# EAGLE design attiny_shield (EAGLE 8.6.1)
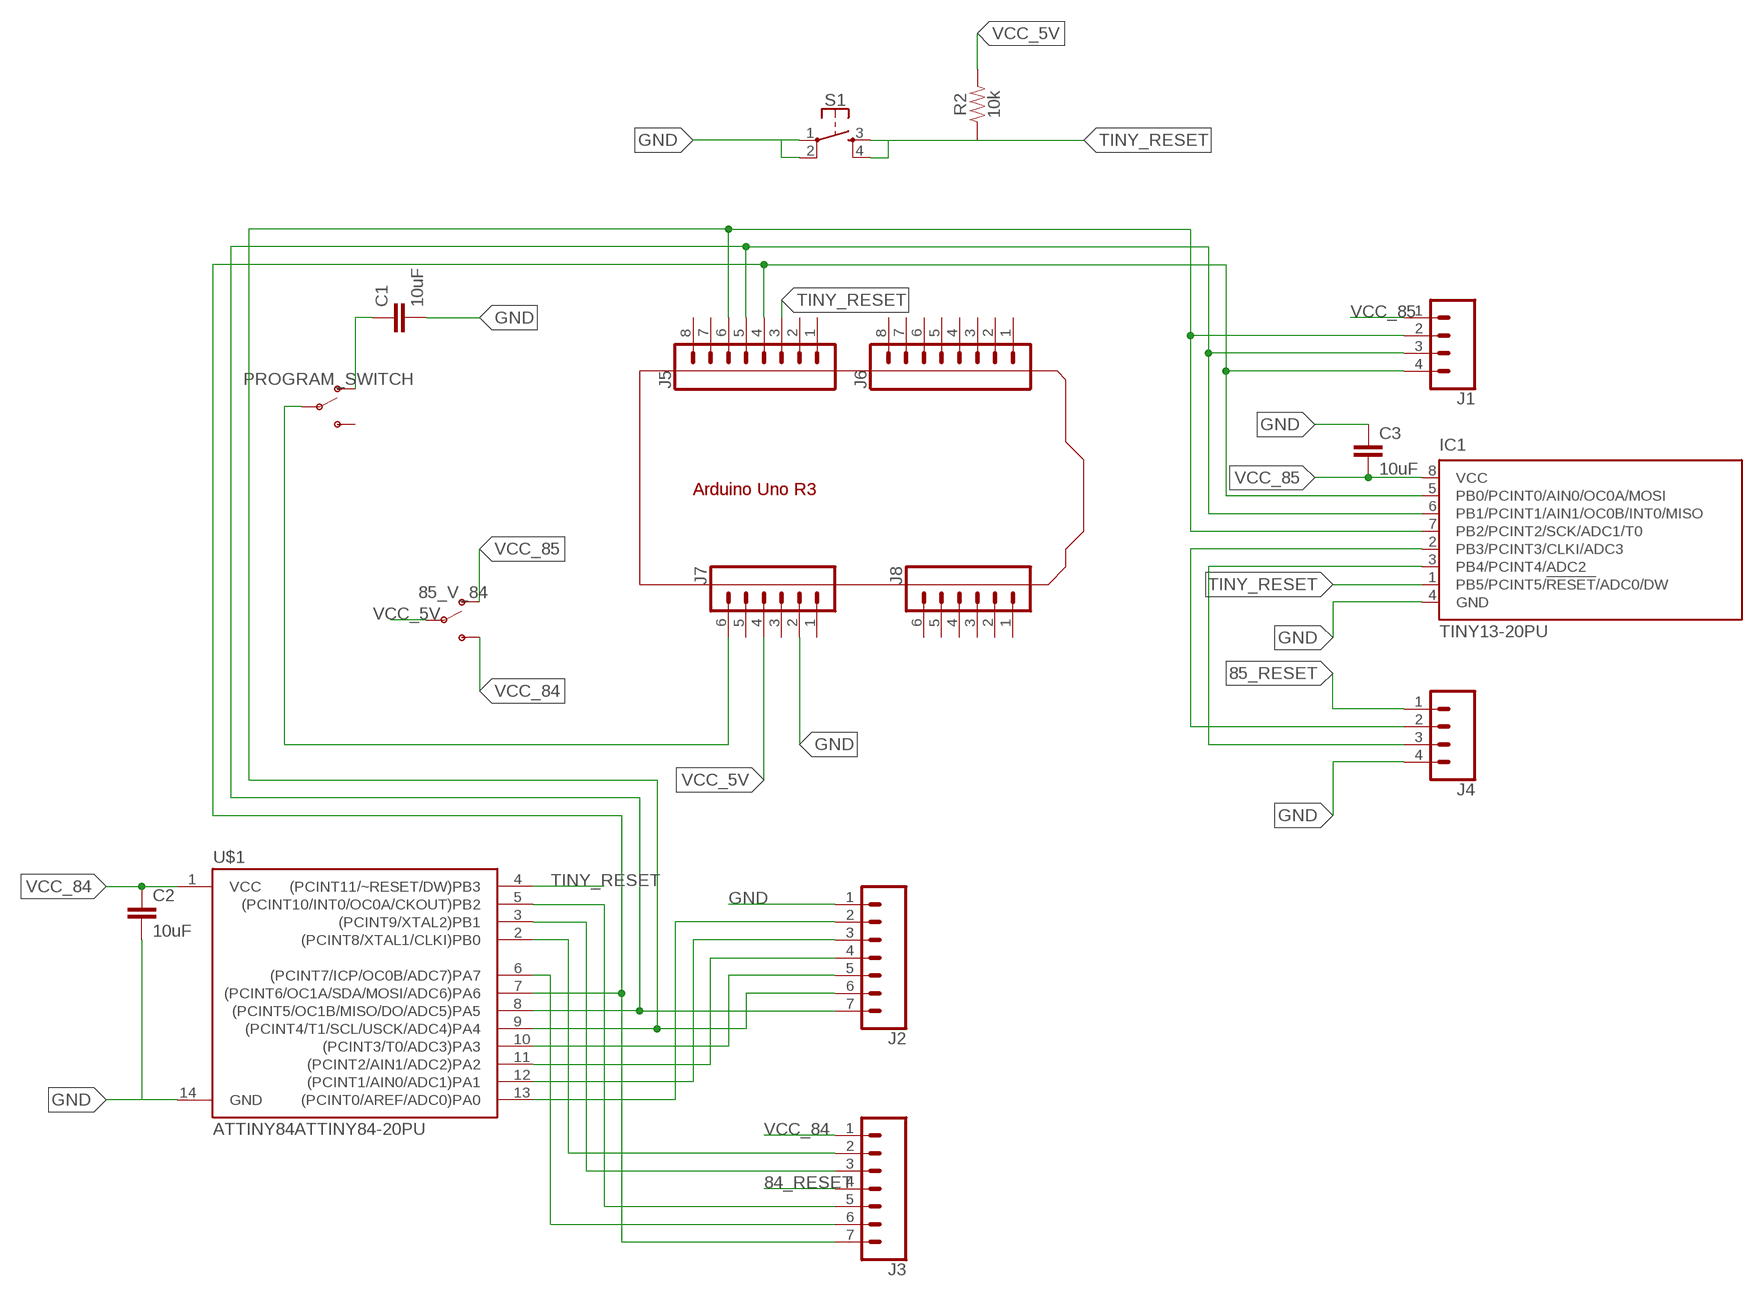
[diagram p0: schematic, sheet 1]

## Parts
85_V_84  SPARKFUN-SWITCHES_SWITCH-SPDT-SMD-AYZ0202  [SPARKFUN-SWITCHES_SWITCH_DPDT_SMD_AYZ0202]
C1  10uF  10UF-0805-10V-10%  [0805]
C2  10uF  10UF-0805-10V-10%  [0805]
C3  10uF  10UF-0805-10V-10%  [0805]
IC1  TINY13-20PU  [DIL08]
J1  CONN_04  [1X04]
J2  CONN_07  [1X07]
J3  CONN_07  [1X07]
J4  CONN_04  [1X04]
J5  CONN_08"  [1X08]
J6  CONN_08"  [1X08]
J7  CONN_06SILK_FEMALE_PTH  [1X06]
J8  CONN_06SILK_FEMALE_PTH  [1X06]
PROGRAM_SWITCH  SWITCH-SPDT-SMD-AYZ0202  [SWITCH_DPDT_SMD_AYZ0202]
R2  10k  SPARKFUN-RESISTORS_10KOHM-0603-1/10W-1%  [SPARKFUN-RESISTORS_0603]
S1  SPARKFUN-SWITCHES_MOMENTARY-SWITCH-SPST-2-SMD-5.2MM  [SPARKFUN-SWITCHES_TACTILE_SWITCH_SMD_5.2MM]
U$1  ATTINY84ATTINY84-20PU  [DIP14]

## Nets
84_0: J2.2 U$1.13((PCINT0/AREF/ADC0)PA0)
84_1: J2.3 U$1.12((PCINT1/AIN0/ADC1)PA1)
84_RESET: J3.4
85_RESET: J4.1
GND: C1.2 C2.2 C3.1 IC1.4(GND) J2.1 J4.4 J7.2 S1.1 S1.2 U$1.14(GND)
MISO: IC1.6(PB1/PCINT1/AIN1/OC0B/INT0/MISO) J1.3 J2.7 J5.5 U$1.8((PCINT5/OC1B/MISO/DO/ADC5)PA5)
MOSI: IC1.5(PB0/PCINT0/AIN0/OC0A/MOSI) J1.4 J3.7 J5.4 U$1.7((PCINT6/OC1A/SDA/MOSI/ADC6)PA6)
N$1: C1.1 PROGRAM_SWITCH.1(O)
N$2: IC1.2(PB3/PCINT3/CLKI/ADC3) J4.2
N$3: IC1.3(PB4/PCINT4/ADC2) J4.3
N$10: J7.6 PROGRAM_SWITCH.2(P)
N$14: J2.4 U$1.11((PCINT2/AIN1/ADC2)PA2)
N$15: J2.5 U$1.10((PCINT3/T0/ADC3)PA3)
N$17: J3.6 U$1.6((PCINT7/ICP/OC0B/ADC7)PA7)
N$18: J3.2 U$1.2((PCINT8/XTAL1/CLKI)PB0)
N$19: J3.3 U$1.3((PCINT9/XTAL2)PB1)
N$20: J3.5 U$1.5((PCINT10/INT0/OC0A/CKOUT)PB2)
SCK: IC1.7(PB2/PCINT2/SCK/ADC1/T0) J1.2 J2.6 J5.6 U$1.9((PCINT4/T1/SCL/USCK/ADC4)PA4)
TINY_RESET: IC1.1(PB5/PCINT5/!RESET!/ADC0/DW) J5.3 R2.1 S1.3 S1.4 U$1.4((PCINT11/~RESET/DW)PB3)
VCC_5V: 85_V_84.2(P) J7.4 R2.2
VCC_84: 85_V_84.3(S) C2.1 J3.1 U$1.1(VCC)
VCC_85: 85_V_84.1(O) C3.2 IC1.8(VCC) J1.1
Unconnected: J5.1 J5.2 J5.7 J5.8 J6.1 J6.2 J6.3 J6.4 J6.5 J6.6 J6.7 J6.8 J7.1 J7.3 J7.5 J8.1 J8.2 J8.3 J8.4 J8.5 J8.6 PROGRAM_SWITCH.3(S)

## Notes on the sheet
- Arduino Uno R3 | Arduino Uno R3

## Library data of the parts
85_V_84 = PianoPiano:SPARKFUN-SWITCHES_SWITCH-SPDT: Single Pole, Double Throw (SPDT) Switch Single-pole, double-throw (SPDT) switch. Variant Overview SMD-AYZ0202 Surface Mount DPDT Switch <https://www.sparkfun.com/products/597> (COM-00597) Used on e.g. LilyPad Arduino USB - ATmega32U4 Board <https://www.sparkfun.com/products/12049> PTH-11.6X4.0MM SPDT Mini Power Switch <https://www.sparkfun.com/products/102> (COM-00102) Used on e.g. SparkFun Simon Says - Through-Hole Soldering Kit <https://www.sparkfun.com/products/10547> (KIT-10547) PTH-11.6X4.0MM-KIT KIT version of SPDT Mini Power Switch - Simplifies soldering by removing tStop of switch pins - only one side can be soldered. PTH-11.6X4.0MM-LOCK LOCK version of SPDT Mini Power Switch - Offset pins hold switch in place for easier soldering. SMD-RIGHT-ANGLE Surface Mount Right Angle Switch <https://www.sparkfun.com/products/10860> (COM-10860) Used on e.g. SparkFun ESP8266 Thing <https://www.sparkfun.com/products/13231>; PROD_ID: SWCH-08179; SF_ID: COM-00597
C1-C3 = SparkFun-Capacitors:10UF: 10.0µF ceramic capacitors A capacitor is a passive two-terminal electrical component used to store electrical energy temporarily in an electric field.; PROD_ID: CAP-11330
IC1 = atmel:TINY13: 8-bit AVR Microcontroller with 1K Bytes In-System Programmable Flash Source: http://www.atmel.com/dyn/resources/prod_documents/2535S.pdf; MPN: ATTINY13-20PU; OC_FARNELL: 9171550; OC_NEWARK: 96K6521
J1 J4 = SparkFun-Connectors:CONN_04: Multi connection point. Often used as Generic Header-pin footprint for 0.1 inch spaced/style header connections On any of the 0.1 inch spaced packages, you can populate with these: Break Away Headers - Straight <https://www.sparkfun.com/products/116> (PRT-00116) Break Away Male Headers - Right Angle <https://www.sparkfun.com/products/553> (PRT-00553) Female Headers <https://www.sparkfun.com/products/115> (PRT-00115) Break Away Headers - Machine Pin <https://www.sparkfun.com/products/117> (PRT-00117) Break Away Female Headers - Swiss Machine Pin <https://www.sparkfun.com/products/743> (PRT-00743) For SCREWTERMINALS and SPRING TERMINALS visit here: Screw Terimnals on SparkFun.com <https://www.sparkfun.com/search/results?term=Screw+Terminals> (5mm/3.5mm/2.54mm spacing) This device is also useful as a general connection point to wire up your design to another part of your project. Our various solder wires solder well into these plated through hole pads. Hook-Up Wire - Assortment (Stranded, 22 AWG) <https://www.sparkfun.com/products/11375> (PRT-11375) Hook-Up Wire - Assortment (Solid Core, 22 AWG) <https://www.sparkfun.com/products/11367> (PRT-11367) View the entire wire category on our website here <https://www.sparkfun.com/categories/141> Special notes: Molex polarized connector foot print use with SKU : PRT-08231 with associated crimp pins and housings. 1MM SMD Version SKU: PRT-10208; PROD_ID: CONN-09696
J2 J3 = SparkFun-Connectors:CONN_07: Multi connection point. Often used as Generic Header-pin footprint for 0.1 inch spaced/style header connections On any of the 0.1 inch spaced packages, you can populate with these: Break Away Headers - Straight <https://www.sparkfun.com/products/116> (PRT-00116) Break Away Male Headers - Right Angle <https://www.sparkfun.com/products/553> (PRT-00553) Female Headers <https://www.sparkfun.com/products/115> (PRT-00115) Break Away Headers - Machine Pin <https://www.sparkfun.com/products/117> (PRT-00117) Break Away Female Headers - Swiss Machine Pin <https://www.sparkfun.com/products/743> (PRT-00743) For SCREWTERMINALS and SPRING TERMINALS visit here: Screw Terimnals on SparkFun.com <https://www.sparkfun.com/search/results?term=Screw+Terminals> (5mm/3.5mm/2.54mm spacing) This device is also useful as a general connection point to wire up your design to another part of your project. Our various solder wires solder well into these plated through hole pads. Hook-Up Wire - Assortment (Stranded, 22 AWG) <https://www.sparkfun.com/products/11375> (PRT-11375) Hook-Up Wire - Assortment (Solid Core, 22 AWG) <https://www.sparkfun.com/products/11367> (PRT-11367) View the entire wire category on our website here <https://www.sparkfun.com/categories/141> Special notes: Molex polarized connector foot print use with SKU : PRT-08231 with associated crimp pins and housings. 1MM SMD Version SKU: PRT-10208 NOTES ON THE VARIANTS LOCK and LOCK_LONGPADS... This footprint was designed to help hold the alignment of a through-hole component (i.e. 6-pin header) while soldering it into place. You may notice that each hole has been shifted either up or down by 0.005 of an inch from it's more standard position (which is a perfectly straight line). This slight alteration caused the pins (the squares in the middle) to touch the edges of the holes. Because they are alternating, it causes a "brace" to hold the component in place. 0.005 has proven to be the perfect amount of "off-center" position when using our standard breakaway headers. Although looks a little odd when you look at the bare footprint, once you have a header in there, the alteration is very hard to notice. Also,if you push a header all the way into place, it is covered up entirely on the bottom side.
J5 J6 = SparkFun-Connectors:CONN_08: Multi connection point. Often used as Generic Header-pin footprint for 0.1 inch spaced/style header connections On any of the 0.1 inch spaced packages, you can populate with these: Break Away Headers - Straight <https://www.sparkfun.com/products/116> (PRT-00116) Break Away Male Headers - Right Angle <https://www.sparkfun.com/products/553> (PRT-00553) Female Headers <https://www.sparkfun.com/products/115> (PRT-00115) Break Away Headers - Machine Pin <https://www.sparkfun.com/products/117> (PRT-00117) Break Away Female Headers - Swiss Machine Pin <https://www.sparkfun.com/products/743> (PRT-00743) Arduino Stackable Header - 8 Pin <https://www.sparkfun.com/products/9279> (PRT-09279) For SCREWTERMINALS and SPRING TERMINALS visit here: Screw Terimnals on SparkFun.com <https://www.sparkfun.com/search/results?term=Screw+Terminals> (5mm/3.5mm/2.54mm spacing) This device is also useful as a general connection point to wire up your design to another part of your project. Our various solder wires solder well into these plated through hole pads. Hook-Up Wire - Assortment (Stranded, 22 AWG) <https://www.sparkfun.com/products/11375> (PRT-11375) Hook-Up Wire - Assortment (Solid Core, 22 AWG) <https://www.sparkfun.com/products/11367> (PRT-11367) View the entire wire category on our website here <https://www.sparkfun.com/categories/141> Special notes: Molex polarized connector foot print use with SKU : PRT-08231 with associated crimp pins and housings. 1MM SMD Version SKU: PRT-10208 NOTES ON THE VARIANTS LOCK and LOCK_LONGPADS... This footprint was designed to help hold the alignment of a through-hole component (i.e. 6-pin header) while soldering it into place. You may notice that each hole has been shifted either up or down by 0.005 of an inch from it's more standard position (which is a perfectly straight line). This slight alteration caused the pins (the squares in the middle) to touch the edges of the holes. Because they are alternating, it causes a "brace" to hold the component in place. 0.005 has proven to be the perfect amount of "off-center" position when using our standard breakaway headers. Although looks a little odd when you look at the bare footprint, once you have a header in there, the alteration is very hard to notice. Also,if you push a header all the way into place, it is covered up entirely on the bottom side.; PROD_ID: CONN-08438
J7 J8 = SparkFun-Connectors:CONN_06: Multi connection point. Often used as Generic Header-pin footprint for 0.1 inch spaced/style header connections On any of the 0.1 inch spaced packages, you can populate with these: Break Away Headers - Straight <https://www.sparkfun.com/products/116> (PRT-00116) Break Away Male Headers - Right Angle <https://www.sparkfun.com/products/553> (PRT-00553) Female Headers <https://www.sparkfun.com/products/115> (PRT-00115) Break Away Headers - Machine Pin <https://www.sparkfun.com/products/117> (PRT-00117) Break Away Female Headers - Swiss Machine Pin <https://www.sparkfun.com/products/743> (PRT-00743) Arduino Stackable Header - 6 Pin <https://www.sparkfun.com/products/9280> (PRT-09280) For SCREWTERMINALS and SPRING TERMINALS visit here: Screw Terimnals on SparkFun.com <https://www.sparkfun.com/search/results?term=Screw+Terminals> (5mm/3.5mm/2.54mm spacing) This device is also useful as a general connection point to wire up your design to another part of your project. Our various solder wires solder well into these plated through hole pads. Hook-Up Wire - Assortment (Stranded, 22 AWG) <https://www.sparkfun.com/products/11375> (PRT-11375) Hook-Up Wire - Assortment (Solid Core, 22 AWG) <https://www.sparkfun.com/products/11367> (PRT-11367) View the entire wire category on our website here <https://www.sparkfun.com/categories/141>; PROD_ID: CONN-08437
PROGRAM_SWITCH = SparkFun-Switches:SWITCH-SPDT: Single Pole, Double Throw (SPDT) Switch Single-pole, double-throw (SPDT) switch. Variant Overview SMD-AYZ0202 Surface Mount DPDT Switch <https://www.sparkfun.com/products/597> (COM-00597) Used on e.g. LilyPad Arduino USB - ATmega32U4 Board <https://www.sparkfun.com/products/12049> PTH-11.6X4.0MM SPDT Mini Power Switch <https://www.sparkfun.com/products/102> (COM-00102) Used on e.g. SparkFun Simon Says - Through-Hole Soldering Kit <https://www.sparkfun.com/products/10547> (KIT-10547) PTH-11.6X4.0MM-KIT KIT version of SPDT Mini Power Switch - Simplifies soldering by removing tStop of switch pins - only one side can be soldered. PTH-11.6X4.0MM-LOCK LOCK version of SPDT Mini Power Switch - Offset pins hold switch in place for easier soldering. SMD-RIGHT-ANGLE Surface Mount Right Angle Switch <https://www.sparkfun.com/products/10860> (COM-10860) Used on e.g. SparkFun ESP8266 Thing <https://www.sparkfun.com/products/13231>; PROD_ID: SWCH-08179; SF_ID: COM-00597
R2 = PianoPiano:SPARKFUN-RESISTORS_10KOHM: 10kΩ resistor A resistor is a passive two-terminal electrical component that implements electrical resistance as a circuit element. Resistors act to reduce current flow, and, at the same time, act to lower voltage levels within circuits. - Wikipedia; PROD_ID: RES-00824
S1 = PianoPiano:SPARKFUN-SWITCHES_MOMENTARY-SWITCH-SPST-2: Momentary Switch (Pushbutton) - SPST - Two Circuits Normally-open (NO) SPST momentary switches (buttons, pushbuttons). Schematic symbol includes two switch circuits. Variants SMD-4.6MMX2.8MM - 4.60mm x 2.80mm Tactile Momentary Button Switch - Used on SparkFun SAMD21 Mini Breakout <https://www.sparkfun.com/products/13664> SMD-5.2MM - Mini Pushbutton Switch - SMD <https://www.sparkfun.com/products/8720> - Used on Arduino Pro Mini <https://www.sparkfun.com/products/11114>; PROD_ID: SWCH-08247; SF_SKU: COM-08720
U$1 = SparkFun-IC-Microcontroller:ATTINY84: Atmel 14-pin 2/4/8kB flash uC Datasheet <https://cdn.sparkfun.com/datasheets/Widgets/doc8006.pdf> SparkFun Products Tiny AVR Programmer <https://www.sparkfun.com/products/11801> (PGM-11801) SparkFun Servo Trigger - Continuous Rotation <https://www.sparkfun.com/products/13872> (WIG-13872) SparkFun Servo Trigger <https://www.sparkfun.com/products/13118> (WIG-13118)

## Board
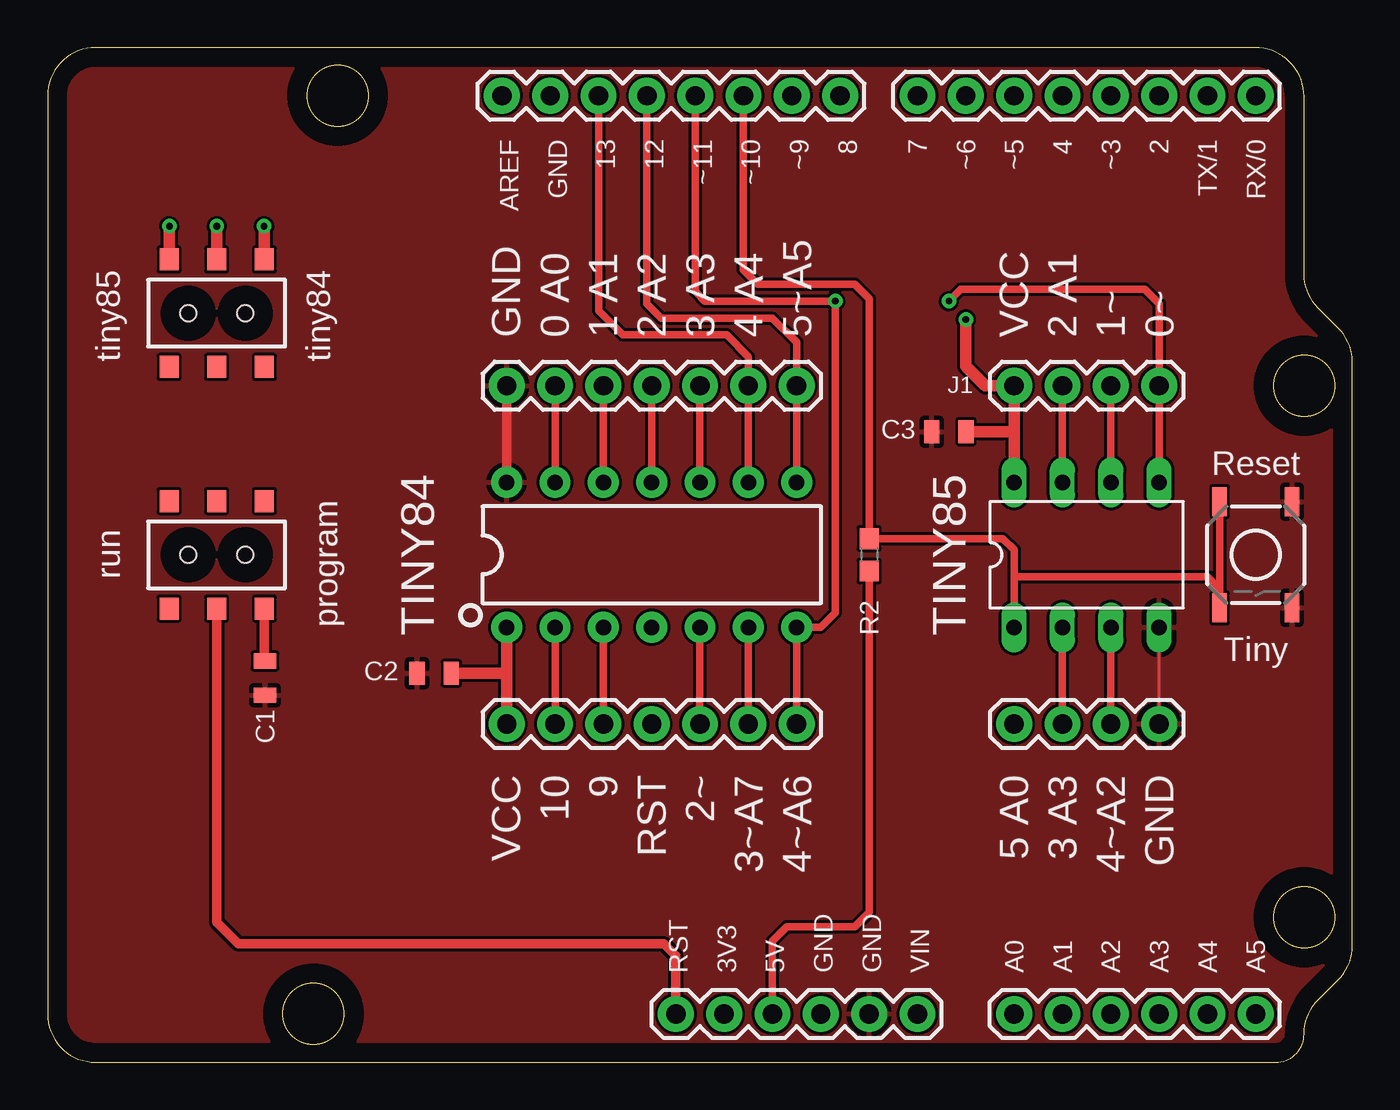
[diagram p1: board, top side]
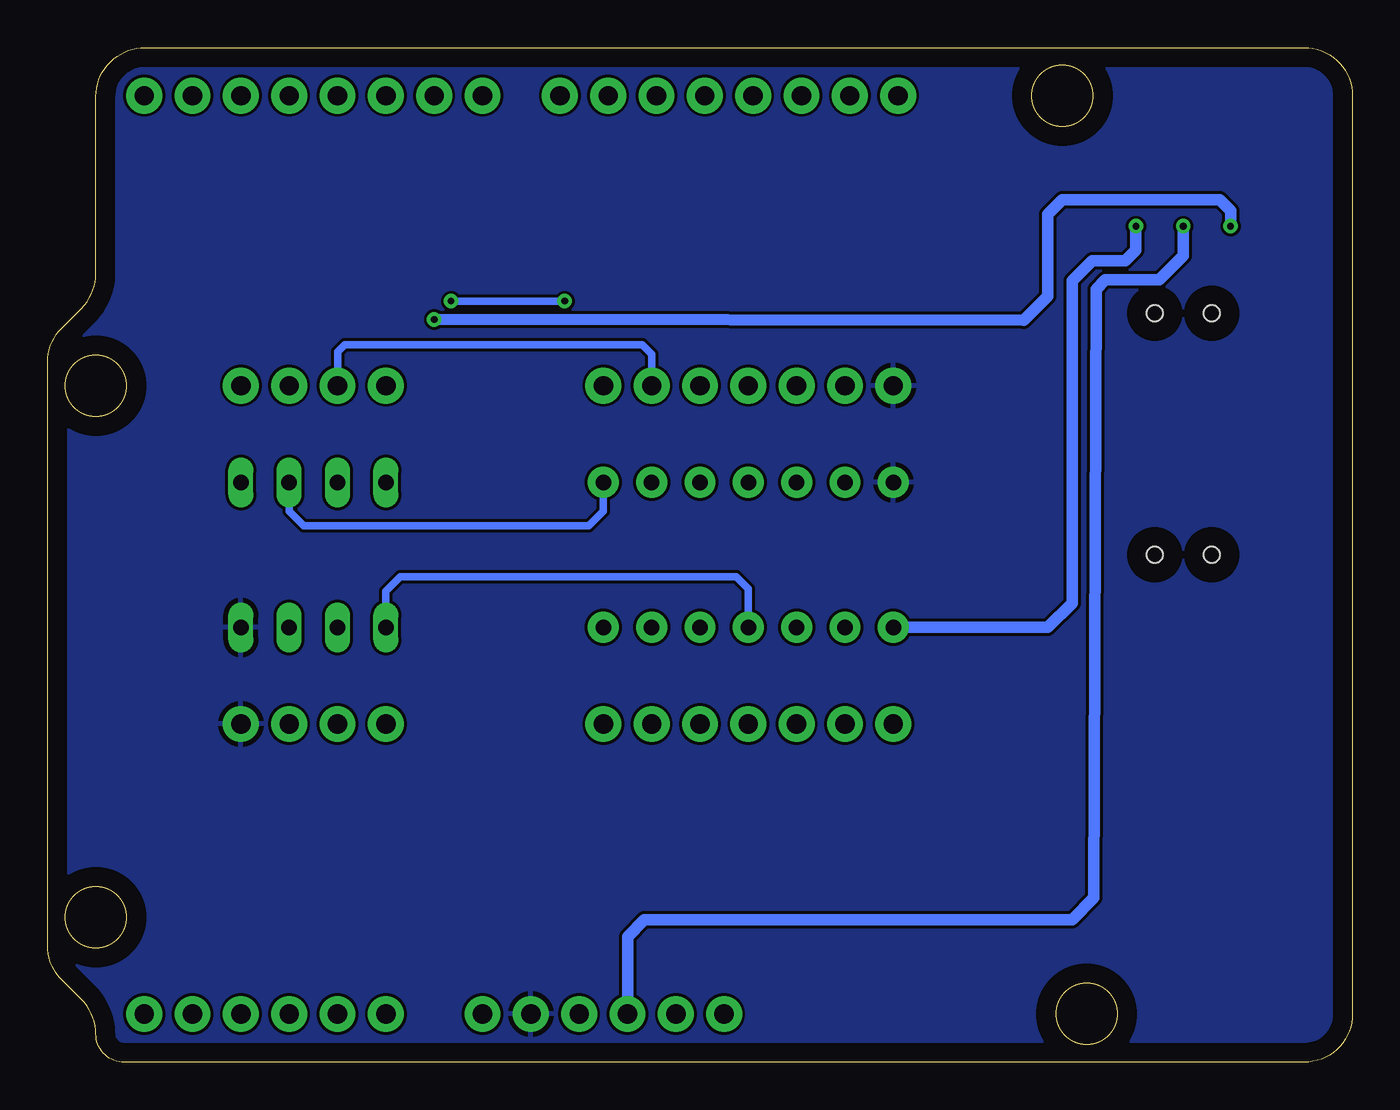
[diagram p2: board, bottom side, seen from below]

Size 68.58 x 53.33 mm. Coordinates in mm from the lower left corner, seen from the top.
Outline: 0,50.79 0,2.54 arc90 2.54,0 64.55,0 arc90 66.04,1.49 arc-45 66.78,3.28 67.84,4.34 arc45 68.58,6.13 68.58,36.79 arc45 67.84,38.59 66.78,39.64 arc-45 66.04,41.44 66.04,50.76 arc45 65.3,52.56 65.27,52.59 arc45 63.47,53.33 2.54,53.33 arc90 0,50.79
Outline: circle at 15.24,50.8 radius 1.61
Outline: circle at 66.04,35.56 radius 1.61
Outline: circle at 66.04,7.62 radius 1.61
Outline: circle at 13.97,2.54 radius 1.61
Copper layers (1*16): Top 0.035mm / dielectric 1.5mm / Bottom 0.035mm
Design rules "default": minimum track width 6mil, minimum drill 0.35mm, track to track 6mil, track to pad 6mil, pad to pad 6mil, via to via 6mil, smd to smd 6mil, copper to edge 40mil, drill to drill 6mil, minimum pad ring 10mil, minimum via ring 8mil, stop-mask expansion 4mil, vias tented up to drill 0mil, thermal gap 10mil

### Footprints (pad centres in the part's own frame; a part is rotated, then mirrored left to right if it is on the bottom)
SPARKFUN-SWITCHES_SWITCH_DPDT_SMD_AYZ0202 = smd 1 x 1.15: 1 -2.5,2.825; 2 0,2.825; 3 2.5,2.825; 4 -2.5,-2.825; 5 0,-2.825; 6 2.5,-2.825 | hole 0.85: 1.5,0; -1.5,0
0805 = smd 0.8 x 1.2: 1 -0.9,0; 2 0.9,0
DIL08 = drill 0.813 long: 1 -3.81,-3.81; 2 -1.27,-3.81; 3 1.27,-3.81; 4 3.81,-3.81; 5 3.81,3.81; 6 1.27,3.81; 7 -1.27,3.81; 8 -3.81,3.81
1X04 = drill 1.016 pad 1.88: 1 0,0; 2 2.54,0; 3 5.08,0; 4 7.62,0
1X07 = drill 1.016 pad 1.88: 1 0,0; 2 2.54,0; 3 5.08,0; 4 7.62,0; 5 10.16,0; 6 12.7,0; 7 15.24,0
1X08 = drill 1.016 pad 1.88: 1 0,0; 2 2.54,0; 3 5.08,0; 4 7.62,0; 5 10.16,0; 6 12.7,0; 7 15.24,0; 8 17.78,0
1X06 = drill 1.016 pad 1.88: 1 0,0; 2 2.54,0; 3 5.08,0; 4 7.62,0; 5 10.16,0; 6 12.7,0
SWITCH_DPDT_SMD_AYZ0202 = smd 1 x 1.15: 1 -2.5,2.825; 2 0,2.825; 3 2.5,2.825; 4 -2.5,-2.825; 5 0,-2.825; 6 2.5,-2.825 | hole 0.85: 1.5,0; -1.5,0
SPARKFUN-RESISTORS_0603 = smd 1.1 x 1: 1 -0.85,0; 2 0.85,0
SPARKFUN-SWITCHES_TACTILE_SWITCH_SMD_5.2MM = smd 1.524 x 0.762: 1 -2.794,1.905; 2 2.794,1.905; 3 -2.794,-1.905; 4 2.794,-1.905
DIP14 = drill 0.813 pad 1.626: 1 -7.62,-3.81; 2 -5.08,-3.81; 3 -2.54,-3.81; 4 0,-3.81; 5 2.54,-3.81; 6 5.08,-3.81; 7 7.62,-3.81; 8 7.62,3.81; 9 5.08,3.81; 10 2.54,3.81; 11 0,3.81; 12 -2.54,3.81; 13 -5.08,3.81; 14 -7.62,3.81

### Placement (x,y rotation side)
85_V_84  8.89,39.37 0 top
C1  11.43,20.19 270 top
C2  20.32,20.45 180 top
C3  47.37,33.15 0 top
IC1  54.61,26.67 0 top
J1  50.8,35.56 0 top
J2  24.13,35.56 0 top
J3  24.13,17.78 0 top
J4  50.8,17.78 0 top
J5  41.66,50.8 180 top
J6  63.5,50.8 180 top
J7  45.72,2.54 180 top
J8  63.5,2.54 180 top
PROGRAM_SWITCH  8.89,26.67 180 top
R2  43.18,26.67 270 top
S1  63.5,26.67 270 top
U$1  31.75,26.67 0 top

### Tracks (layer width: path | path; a pad name or v marks a point on that pad's centre or on a via)
84_0
  Top 0.406: J2.2 U$1.13
84_1
  Top 0.406: J2.3 U$1.12
GND
  Top 0.152: J4.4 IC1.4
  Top 0.508: U$1.14 J2.1
  pour Top: 0,0 0,53.34 66.04,53.34 66.04,40.64 68.58,40.64 68.58,2.54 66.04,2.54 66.04,0
  pour Bottom: 0,0 0,53.34 66.04,53.34 66.04,40.64 68.58,40.64 68.58,2.54 66.04,2.54 66.04,0
MISO
  Top 0.406: J1.3 IC1.6 | 39.37,35.05 U$1.8 | J5.5 31.5,39.88 32.26,39.12 38.1,39.12 39.37,37.85 J2.7
  Top 0.508: J2.7 39.37,35.05
  Bottom 0.406: U$1.8 39.37,28.96 40.13,28.19 55.12,28.19 55.88,28.96 IC1.6
MOSI  (via drill 0.35)
  Top 0.406: IC1.5 J1.4 58.42,39.88 57.66,40.64 48.01,40.64 v47.37,40.01 | J3.7 U$1.7 40.64,22.86 41.4,23.62 v41.4,40.01 34.54,40.01 34.04,40.51 J5.4
  Bottom 0.406: v41.4,40.01 v47.37,40.01
N$1
  Top 0.508: PROGRAM_SWITCH.1 11.39,21.13 C1.1
N$2
  Top 0.406: J4.2 IC1.2
N$3
  Top 0.406: J4.3 IC1.3
N$10
  Top 0.508: J7.6 33.02,5.59 32.38,6.22 10.03,6.22 8.89,7.37 PROGRAM_SWITCH.2
N$14
  Top 0.406: J2.4 U$1.11
N$15
  Top 0.406: J2.5 U$1.10
N$17
  Top 0.406: J3.6 U$1.6
N$18
  Top 0.406: J3.2 U$1.2
N$19
  Top 0.406: J3.3 U$1.3
N$20
  Top 0.406: J3.5 U$1.5
SCK
  Top 0.406: J1.2 IC1.7 | U$1.9 J2.6 36.83,37.08 35.69,38.23 30.23,38.23 28.96,39.5 J5.6
  Bottom 0.406: J1.2 53.34,37.34 52.96,37.72 37.34,37.72 36.83,37.21 J2.6
TINY_RESET
  Top 0.406: 50.8,25.53 60.96,25.53 61.59,24.89 S1.4 S1.3 | 50.8,24.77 IC1.1 50.8,25.53 | J5.3 36.58,41.66 37.34,40.89 42.42,40.89 43.18,40.13 R2.1 50.2,27.52 50.8,26.92 50.8,25.53
  Bottom 0.406: IC1.1 50.8,24.77 50.04,25.53 32.38,25.53 31.75,24.89 U$1.4
VCC_5V  (via drill 0.35)
  Top 0.152: 8.89,42.07 85_V_84.2
  Top 0.406: R2.2 43.18,7.87 42.42,7.11 38.86,7.11 38.1,6.35 J7.4
  Top 0.61: v8.89,43.94 85_V_84.2
  Bottom 0.61: v8.89,43.94 8.89,42.39 10.16,41.12 12.99,41.12 13.46,40.64 13.59,8.64 14.73,7.49 37.21,7.49 38.1,6.6 J7.4
VCC_84  (via drill 0.35)
  Top 0.61: U$1.1 24.13,20.32 | 24.13,20.32 J3.1 | v11.38,43.94 11.38,42.21 85_V_84.3 | C2.1 24,20.45 24.13,20.32
  Bottom 0.61: v11.38,43.94 11.38,42.69 11.94,42.13 13.68,42.13 14.73,41.08 14.73,24.13 16,22.86 U$1.1
VCC_85  (via drill 0.35)
  Top 0.406: 50.67,33.15 50.8,33.02
  Top 0.61: IC1.8 50.8,33.02 J1.1 49.28,35.56 48.26,36.58 v48.26,39.04 | 85_V_84.1 v6.39,43.93 v6.4,43.94 | C3.2 50.67,33.15
  Bottom 0.61: v48.26,39.04 17.27,38.99 16,40.26 16,44.58 15.24,45.34 6.99,45.34 6.4,44.76 v6.4,43.94

### Text on the board
tNames: AREF / GND / 13 / 12 / ~11 / ~10 / ~9 / 8 | 7 / ~6 / ~5 / 4 / ~3 / 2 / TX/1 / RX/0 | GND / 0 A0 / 1 A1 / 2 A2 / 3 A3 / 4 A4 / 5~A5 | VCC / 2 A1 / 1~ / 0~ | tiny85 | tiny84 | Reset | TINY84 | TINY85 | run | program | Tiny | VCC / 10 / 9 / RST / 2~ / 3~A7 / 4~A6 | 5 A0 / 3 A3 / 4~A2 / GND | RST / 3V3 / 5V / GND / GND / VIN | A0 / A1 / A2 / A3 / A4 / A5